# Altium schematic sheet Conn_C.SchDoc
size A1
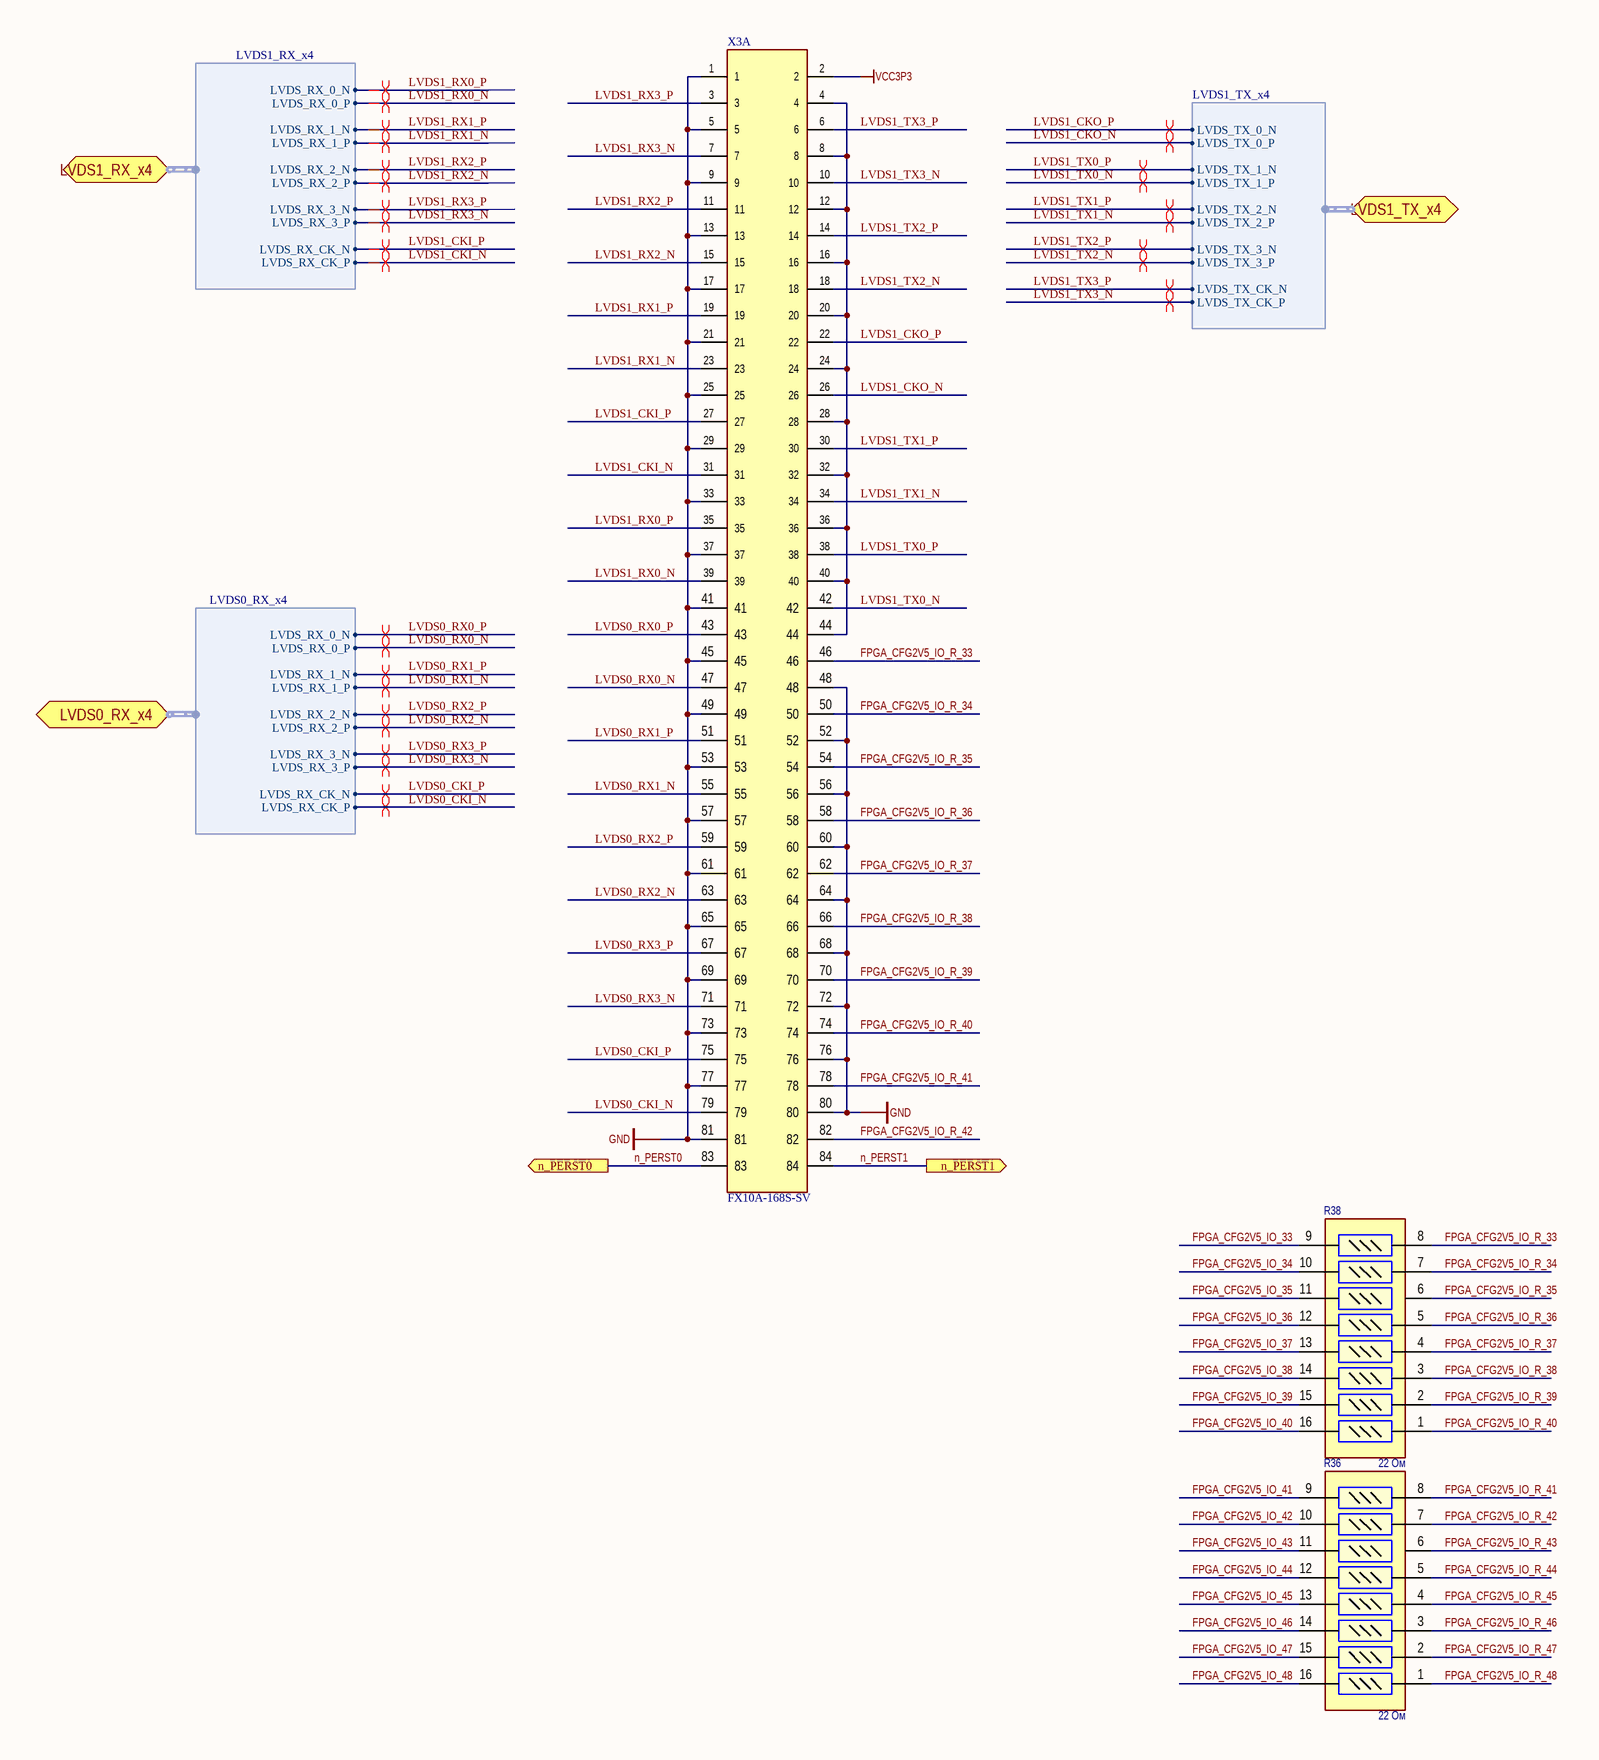
[diagram p0: Conn_C.SchDoc, left]
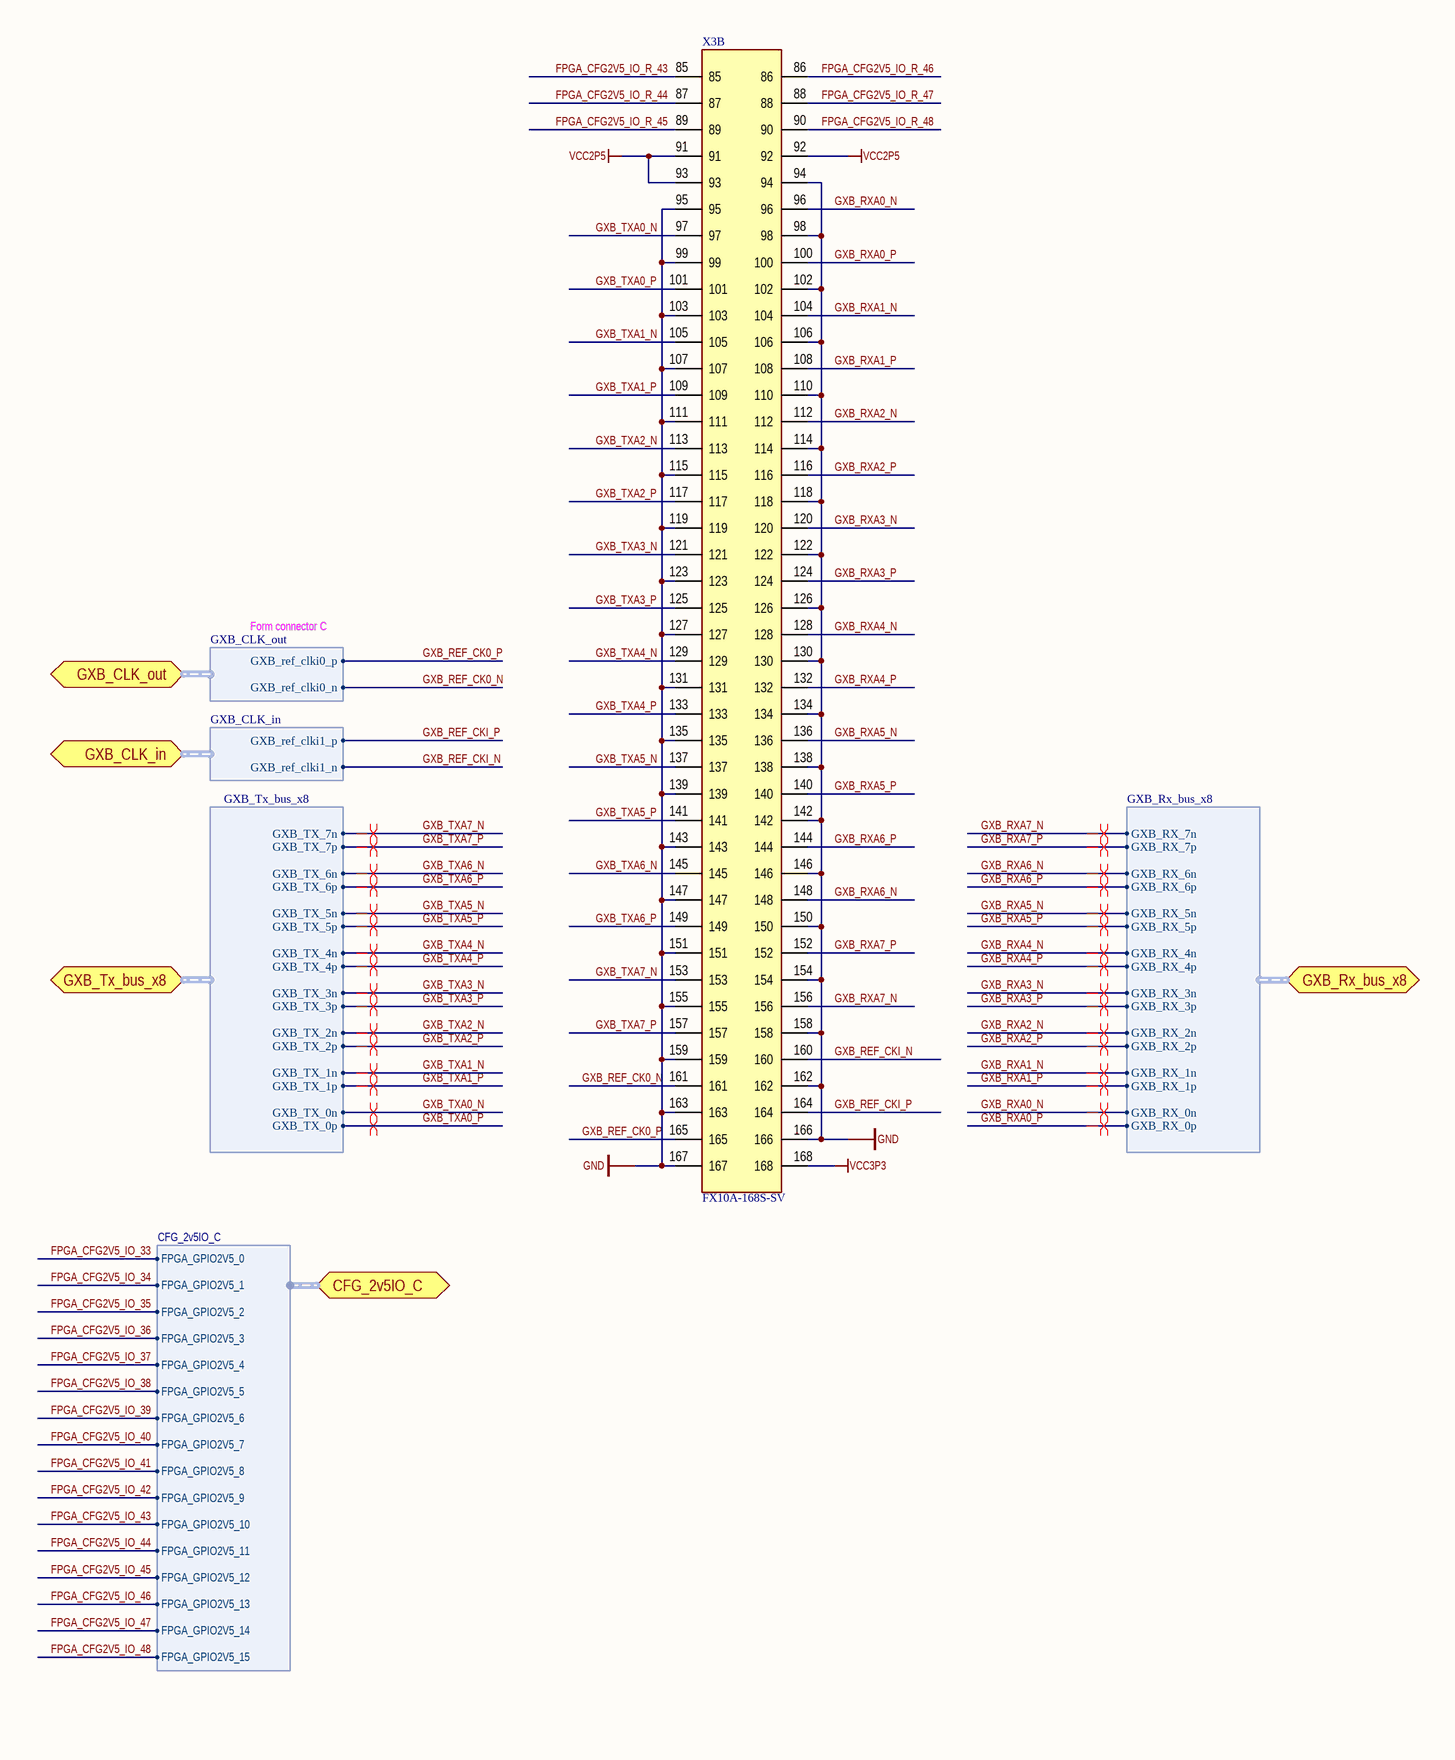
[diagram p1: Conn_C.SchDoc, right]

## Parts
R36  value 22 Ом  [CAT16-J8]  (hidden comment: YC248-JR-07-22 Ом)
R38  value 22 Ом  [CAT16-J8]  (hidden comment: YC248-JR-07-22 Ом)
X3  FX10A-168S-SV  [FX10A-168S-SV]  (parts A,B of 2)

## Ports
CFG_2v5IO_С (harness CFG_2v5IO_С), GXB_CLK_in (harness GXB_CLK_in), GXB_CLK_out (harness GXB_CLK_out), GXB_Rx_bus_x8 (harness GXB_Rx_bus_x8), GXB_Tx_bus_x8 (harness GXB_Tx_bus_x8), LVDS0_RX_x4 (harness LVDS0_RX_x4), LVDS1_RX_x4 (harness LVDS1_RX_x4), LVDS1_TX_x4 (harness LVDS1_TX_x4), n_PERST0 (out), n_PERST1 (out)

## Harnesses
GXB_Tx_bus_x8: GXB_TX_0p, GXB_TX_0n, GXB_TX_1p, GXB_TX_1n, GXB_TX_2p, GXB_TX_2n, GXB_TX_3p, GXB_TX_3n, GXB_TX_4p, GXB_TX_4n, GXB_TX_5p, GXB_TX_5n, GXB_TX_6p, GXB_TX_6n, GXB_TX_7p, GXB_TX_7n
GXB_Rx_bus_x8: GXB_RX_0p, GXB_RX_0n, GXB_RX_1p, GXB_RX_1n, GXB_RX_2p, GXB_RX_2n, GXB_RX_3p, GXB_RX_3n, GXB_RX_4p, GXB_RX_4n, GXB_RX_5p, GXB_RX_5n, GXB_RX_6p, GXB_RX_6n, GXB_RX_7p, GXB_RX_7n
LVDS0_RX_x4: LVDS_RX_0_P, LVDS_RX_0_N, LVDS_RX_1_P, LVDS_RX_1_N, LVDS_RX_2_P, LVDS_RX_2_N, LVDS_RX_3_P, LVDS_RX_3_N, LVDS_RX_CK_P, LVDS_RX_CK_N
LVDS1_TX_x4: LVDS_TX_0_P, LVDS_TX_0_N, LVDS_TX_1_P, LVDS_TX_1_N, LVDS_TX_2_P, LVDS_TX_2_N, LVDS_TX_3_P, LVDS_TX_3_N, LVDS_TX_CK_P, LVDS_TX_CK_N
LVDS1_RX_x4: LVDS_RX_0_P, LVDS_RX_0_N, LVDS_RX_1_P, LVDS_RX_1_N, LVDS_RX_2_P, LVDS_RX_2_N, LVDS_RX_3_P, LVDS_RX_3_N, LVDS_RX_CK_P, LVDS_RX_CK_N
GXB_CLK_out: GXB_ref_clki0_p, GXB_ref_clki0_n
GXB_CLK_in: GXB_ref_clki1_p, GXB_ref_clki1_n
CFG_2v5IO_С: FPGA_GPIO2V5_0, FPGA_GPIO2V5_1, FPGA_GPIO2V5_2, FPGA_GPIO2V5_3, FPGA_GPIO2V5_4, FPGA_GPIO2V5_5, FPGA_GPIO2V5_6, FPGA_GPIO2V5_7, FPGA_GPIO2V5_8, FPGA_GPIO2V5_9, FPGA_GPIO2V5_10, FPGA_GPIO2V5_11, FPGA_GPIO2V5_12, FPGA_GPIO2V5_13, FPGA_GPIO2V5_14, FPGA_GPIO2V5_15

## Nets
GND: X3.1 X3.5 X3.9 X3.13 X3.17 X3.21 X3.25 X3.29 X3.33 X3.37 X3.41 X3.45 X3.48 X3.49 X3.52 X3.53 X3.56 X3.57 X3.60 X3.61 X3.64 X3.65 X3.68 X3.69 X3.72 X3.73 X3.76 X3.77 X3.80 X3.81 X3.94 X3.95 X3.98 X3.99 X3.102 X3.103 X3.106 X3.107 X3.110 X3.111 X3.114 X3.115 X3.118 X3.119 X3.122 X3.123 X3.126 X3.127 X3.130 X3.131 X3.134 X3.135 X3.138 X3.139 X3.142 X3.143 X3.146 X3.147 X3.150 X3.151 X3.154 X3.155 X3.158 X3.159 X3.162 X3.163 X3.166 X3.167
VCC2P5: X3.91 X3.92 X3.93
VCC3P3: X3.2 X3.168
FPGA_CFG2V5_IO_33: R38.9 ; port CFG_2v5IO_С.FPGA_GPIO2V5_0
FPGA_CFG2V5_IO_34: R38.10 ; port CFG_2v5IO_С.FPGA_GPIO2V5_1
FPGA_CFG2V5_IO_35: R38.11 ; port CFG_2v5IO_С.FPGA_GPIO2V5_2
FPGA_CFG2V5_IO_36: R38.12 ; port CFG_2v5IO_С.FPGA_GPIO2V5_3
FPGA_CFG2V5_IO_37: R38.13 ; port CFG_2v5IO_С.FPGA_GPIO2V5_4
FPGA_CFG2V5_IO_38: R38.14 ; port CFG_2v5IO_С.FPGA_GPIO2V5_5
FPGA_CFG2V5_IO_39: R38.15 ; port CFG_2v5IO_С.FPGA_GPIO2V5_6
FPGA_CFG2V5_IO_40: R38.16 ; port CFG_2v5IO_С.FPGA_GPIO2V5_7
FPGA_CFG2V5_IO_41: R36.9 ; port CFG_2v5IO_С.FPGA_GPIO2V5_8
FPGA_CFG2V5_IO_42: R36.10 ; port CFG_2v5IO_С.FPGA_GPIO2V5_9
FPGA_CFG2V5_IO_43: R36.11 ; port CFG_2v5IO_С.FPGA_GPIO2V5_10
FPGA_CFG2V5_IO_44: R36.12 ; port CFG_2v5IO_С.FPGA_GPIO2V5_11
FPGA_CFG2V5_IO_45: R36.13 ; port CFG_2v5IO_С.FPGA_GPIO2V5_12
FPGA_CFG2V5_IO_46: R36.14 ; port CFG_2v5IO_С.FPGA_GPIO2V5_13
FPGA_CFG2V5_IO_47: R36.15 ; port CFG_2v5IO_С.FPGA_GPIO2V5_14
FPGA_CFG2V5_IO_48: R36.16 ; port CFG_2v5IO_С.FPGA_GPIO2V5_15
FPGA_CFG2V5_IO_R_33: R38.8 X3.46
FPGA_CFG2V5_IO_R_34: R38.7 X3.50
FPGA_CFG2V5_IO_R_35: R38.6 X3.54
FPGA_CFG2V5_IO_R_36: R38.5 X3.58
FPGA_CFG2V5_IO_R_37: R38.4 X3.62
FPGA_CFG2V5_IO_R_38: R38.3 X3.66
FPGA_CFG2V5_IO_R_39: R38.2 X3.70
FPGA_CFG2V5_IO_R_40: R38.1 X3.74
FPGA_CFG2V5_IO_R_41: R36.8 X3.78
FPGA_CFG2V5_IO_R_42: R36.7 X3.82
FPGA_CFG2V5_IO_R_43: R36.6 X3.85
FPGA_CFG2V5_IO_R_44: R36.5 X3.87
FPGA_CFG2V5_IO_R_45: R36.4 X3.89
FPGA_CFG2V5_IO_R_46: R36.3 X3.86
FPGA_CFG2V5_IO_R_47: R36.2 X3.88
FPGA_CFG2V5_IO_R_48: R36.1 X3.90
GXB_REF_CK0_N: X3.161 ; port GXB_CLK_out.GXB_ref_clki0_n
GXB_REF_CK0_P: X3.165 ; port GXB_CLK_out.GXB_ref_clki0_p
GXB_REF_CKI_N: X3.160 ; port GXB_CLK_in.GXB_ref_clki1_n
GXB_REF_CKI_P: X3.164 ; port GXB_CLK_in.GXB_ref_clki1_p
GXB_RXA0_N: X3.96 ; port GXB_Rx_bus_x8.GXB_RX_0n
GXB_RXA0_P: X3.100 ; port GXB_Rx_bus_x8.GXB_RX_0p
GXB_RXA1_N: X3.104 ; port GXB_Rx_bus_x8.GXB_RX_1n
GXB_RXA1_P: X3.108 ; port GXB_Rx_bus_x8.GXB_RX_1p
GXB_RXA2_N: X3.112 ; port GXB_Rx_bus_x8.GXB_RX_2n
GXB_RXA2_P: X3.116 ; port GXB_Rx_bus_x8.GXB_RX_2p
GXB_RXA3_N: X3.120 ; port GXB_Rx_bus_x8.GXB_RX_3n
GXB_RXA3_P: X3.124 ; port GXB_Rx_bus_x8.GXB_RX_3p
GXB_RXA4_N: X3.128 ; port GXB_Rx_bus_x8.GXB_RX_4n
GXB_RXA4_P: X3.132 ; port GXB_Rx_bus_x8.GXB_RX_4p
GXB_RXA5_N: X3.136 ; port GXB_Rx_bus_x8.GXB_RX_5n
GXB_RXA5_P: X3.140 ; port GXB_Rx_bus_x8.GXB_RX_5p
GXB_RXA6_N: X3.148 ; port GXB_Rx_bus_x8.GXB_RX_6n
GXB_RXA6_P: X3.144 ; port GXB_Rx_bus_x8.GXB_RX_6p
GXB_RXA7_N: X3.156 ; port GXB_Rx_bus_x8.GXB_RX_7n
GXB_RXA7_P: X3.152 ; port GXB_Rx_bus_x8.GXB_RX_7p
GXB_TXA0_N: X3.97 ; port GXB_Tx_bus_x8.GXB_TX_0n
GXB_TXA0_P: X3.101 ; port GXB_Tx_bus_x8.GXB_TX_0p
GXB_TXA1_N: X3.105 ; port GXB_Tx_bus_x8.GXB_TX_1n
GXB_TXA1_P: X3.109 ; port GXB_Tx_bus_x8.GXB_TX_1p
GXB_TXA2_N: X3.113 ; port GXB_Tx_bus_x8.GXB_TX_2n
GXB_TXA2_P: X3.117 ; port GXB_Tx_bus_x8.GXB_TX_2p
GXB_TXA3_N: X3.121 ; port GXB_Tx_bus_x8.GXB_TX_3n
GXB_TXA3_P: X3.125 ; port GXB_Tx_bus_x8.GXB_TX_3p
GXB_TXA4_N: X3.129 ; port GXB_Tx_bus_x8.GXB_TX_4n
GXB_TXA4_P: X3.133 ; port GXB_Tx_bus_x8.GXB_TX_4p
GXB_TXA5_N: X3.137 ; port GXB_Tx_bus_x8.GXB_TX_5n
GXB_TXA5_P: X3.141 ; port GXB_Tx_bus_x8.GXB_TX_5p
GXB_TXA6_N: X3.145 ; port GXB_Tx_bus_x8.GXB_TX_6n
GXB_TXA6_P: X3.149 ; port GXB_Tx_bus_x8.GXB_TX_6p
GXB_TXA7_N: X3.153 ; port GXB_Tx_bus_x8.GXB_TX_7n
GXB_TXA7_P: X3.157 ; port GXB_Tx_bus_x8.GXB_TX_7p
LVDS0_CKI_N: X3.79 ; port LVDS0_RX_x4.LVDS_RX_CK_P
LVDS0_CKI_P: X3.75 ; port LVDS0_RX_x4.LVDS_RX_CK_N
LVDS0_RX0_N: X3.47 ; port LVDS0_RX_x4.LVDS_RX_0_P
LVDS0_RX0_P: X3.43 ; port LVDS0_RX_x4.LVDS_RX_0_N
LVDS0_RX1_N: X3.55 ; port LVDS0_RX_x4.LVDS_RX_1_P
LVDS0_RX1_P: X3.51 ; port LVDS0_RX_x4.LVDS_RX_1_N
LVDS0_RX2_N: X3.63 ; port LVDS0_RX_x4.LVDS_RX_2_P
LVDS0_RX2_P: X3.59 ; port LVDS0_RX_x4.LVDS_RX_2_N
LVDS0_RX3_N: X3.71 ; port LVDS0_RX_x4.LVDS_RX_3_P
LVDS0_RX3_P: X3.67 ; port LVDS0_RX_x4.LVDS_RX_3_N
LVDS1_CKI_N: X3.31 ; port LVDS1_RX_x4.LVDS_RX_CK_P
LVDS1_CKI_P: X3.27 ; port LVDS1_RX_x4.LVDS_RX_CK_N
LVDS1_CKO_N: X3.26 ; port LVDS1_TX_x4.LVDS_TX_0_P
LVDS1_CKO_P: X3.22 ; port LVDS1_TX_x4.LVDS_TX_0_N
LVDS1_RX0_N: X3.39 ; port LVDS1_RX_x4.LVDS_RX_0_P
LVDS1_RX0_P: X3.35 ; port LVDS1_RX_x4.LVDS_RX_0_N
LVDS1_RX1_N: X3.23 ; port LVDS1_RX_x4.LVDS_RX_1_P
LVDS1_RX1_P: X3.19 ; port LVDS1_RX_x4.LVDS_RX_1_N
LVDS1_RX2_N: X3.15 ; port LVDS1_RX_x4.LVDS_RX_2_P
LVDS1_RX2_P: X3.11 ; port LVDS1_RX_x4.LVDS_RX_2_N
LVDS1_RX3_N: X3.7 ; port LVDS1_RX_x4.LVDS_RX_3_P
LVDS1_RX3_P: X3.3 ; port LVDS1_RX_x4.LVDS_RX_3_N
LVDS1_TX0_N: X3.42 ; port LVDS1_TX_x4.LVDS_TX_1_P
LVDS1_TX0_P: X3.38 ; port LVDS1_TX_x4.LVDS_TX_1_N
LVDS1_TX1_N: X3.34 ; port LVDS1_TX_x4.LVDS_TX_2_P
LVDS1_TX1_P: X3.30 ; port LVDS1_TX_x4.LVDS_TX_2_N
LVDS1_TX2_N: X3.18 ; port LVDS1_TX_x4.LVDS_TX_3_P
LVDS1_TX2_P: X3.14 ; port LVDS1_TX_x4.LVDS_TX_3_N
LVDS1_TX3_N: X3.10 ; port LVDS1_TX_x4.LVDS_TX_CK_P
LVDS1_TX3_P: X3.6 ; port LVDS1_TX_x4.LVDS_TX_CK_N
n_PERST0: X3.83 ; port n_PERST0
n_PERST1: X3.84 ; port n_PERST1
NetX3_4: X3.4 X3.8 X3.12 X3.16 X3.20 X3.24 X3.28 X3.32 X3.36 X3.40 X3.44

## Layout directives
differential pair: GXB_RXA0_N, GXB_RXA0_P, GXB_RXA1_N, GXB_RXA1_P, GXB_RXA2_N, GXB_RXA2_P, GXB_RXA3_N, GXB_RXA3_P, GXB_RXA4_N, GXB_RXA4_P, GXB_RXA5_N, GXB_RXA5_P, GXB_RXA6_N, GXB_RXA6_P, GXB_RXA7_N, GXB_RXA7_P, GXB_TXA0_N, GXB_TXA0_P, GXB_TXA1_N, GXB_TXA1_P, GXB_TXA2_N, GXB_TXA2_P, GXB_TXA3_N, GXB_TXA3_P, GXB_TXA4_N, GXB_TXA4_P, GXB_TXA5_N, GXB_TXA5_P, GXB_TXA6_N, GXB_TXA6_P, GXB_TXA7_N, GXB_TXA7_P, LVDS0_CKI_N, LVDS0_CKI_P, LVDS0_RX0_N, LVDS0_RX0_P, LVDS0_RX1_N, LVDS0_RX1_P, LVDS0_RX2_N, LVDS0_RX2_P, LVDS0_RX3_N, LVDS0_RX3_P, LVDS1_CKI_N, LVDS1_CKI_P, LVDS1_CKO_N, LVDS1_CKO_P, LVDS1_RX0_N, LVDS1_RX0_P, LVDS1_RX1_N, LVDS1_RX1_P, LVDS1_RX2_N, LVDS1_RX2_P, LVDS1_RX3_N, LVDS1_RX3_P, LVDS1_TX0_N, LVDS1_TX0_P, LVDS1_TX1_N, LVDS1_TX1_P, LVDS1_TX2_N, LVDS1_TX2_P, LVDS1_TX3_N, LVDS1_TX3_P

## Notes on the sheet
- Form connector C

## Library data of the parts
R36 R38 = YC248-JR-07-#: Набор чип резисторов; P: 0.062 Вт; Supplier 1: Digi-Key; Supplier Part Number 1: YC248-JR-0722RL